# EAGLE design simple-differential-electrostatic-rev1 (EAGLE 6.1)

## Sheet 1 of 4
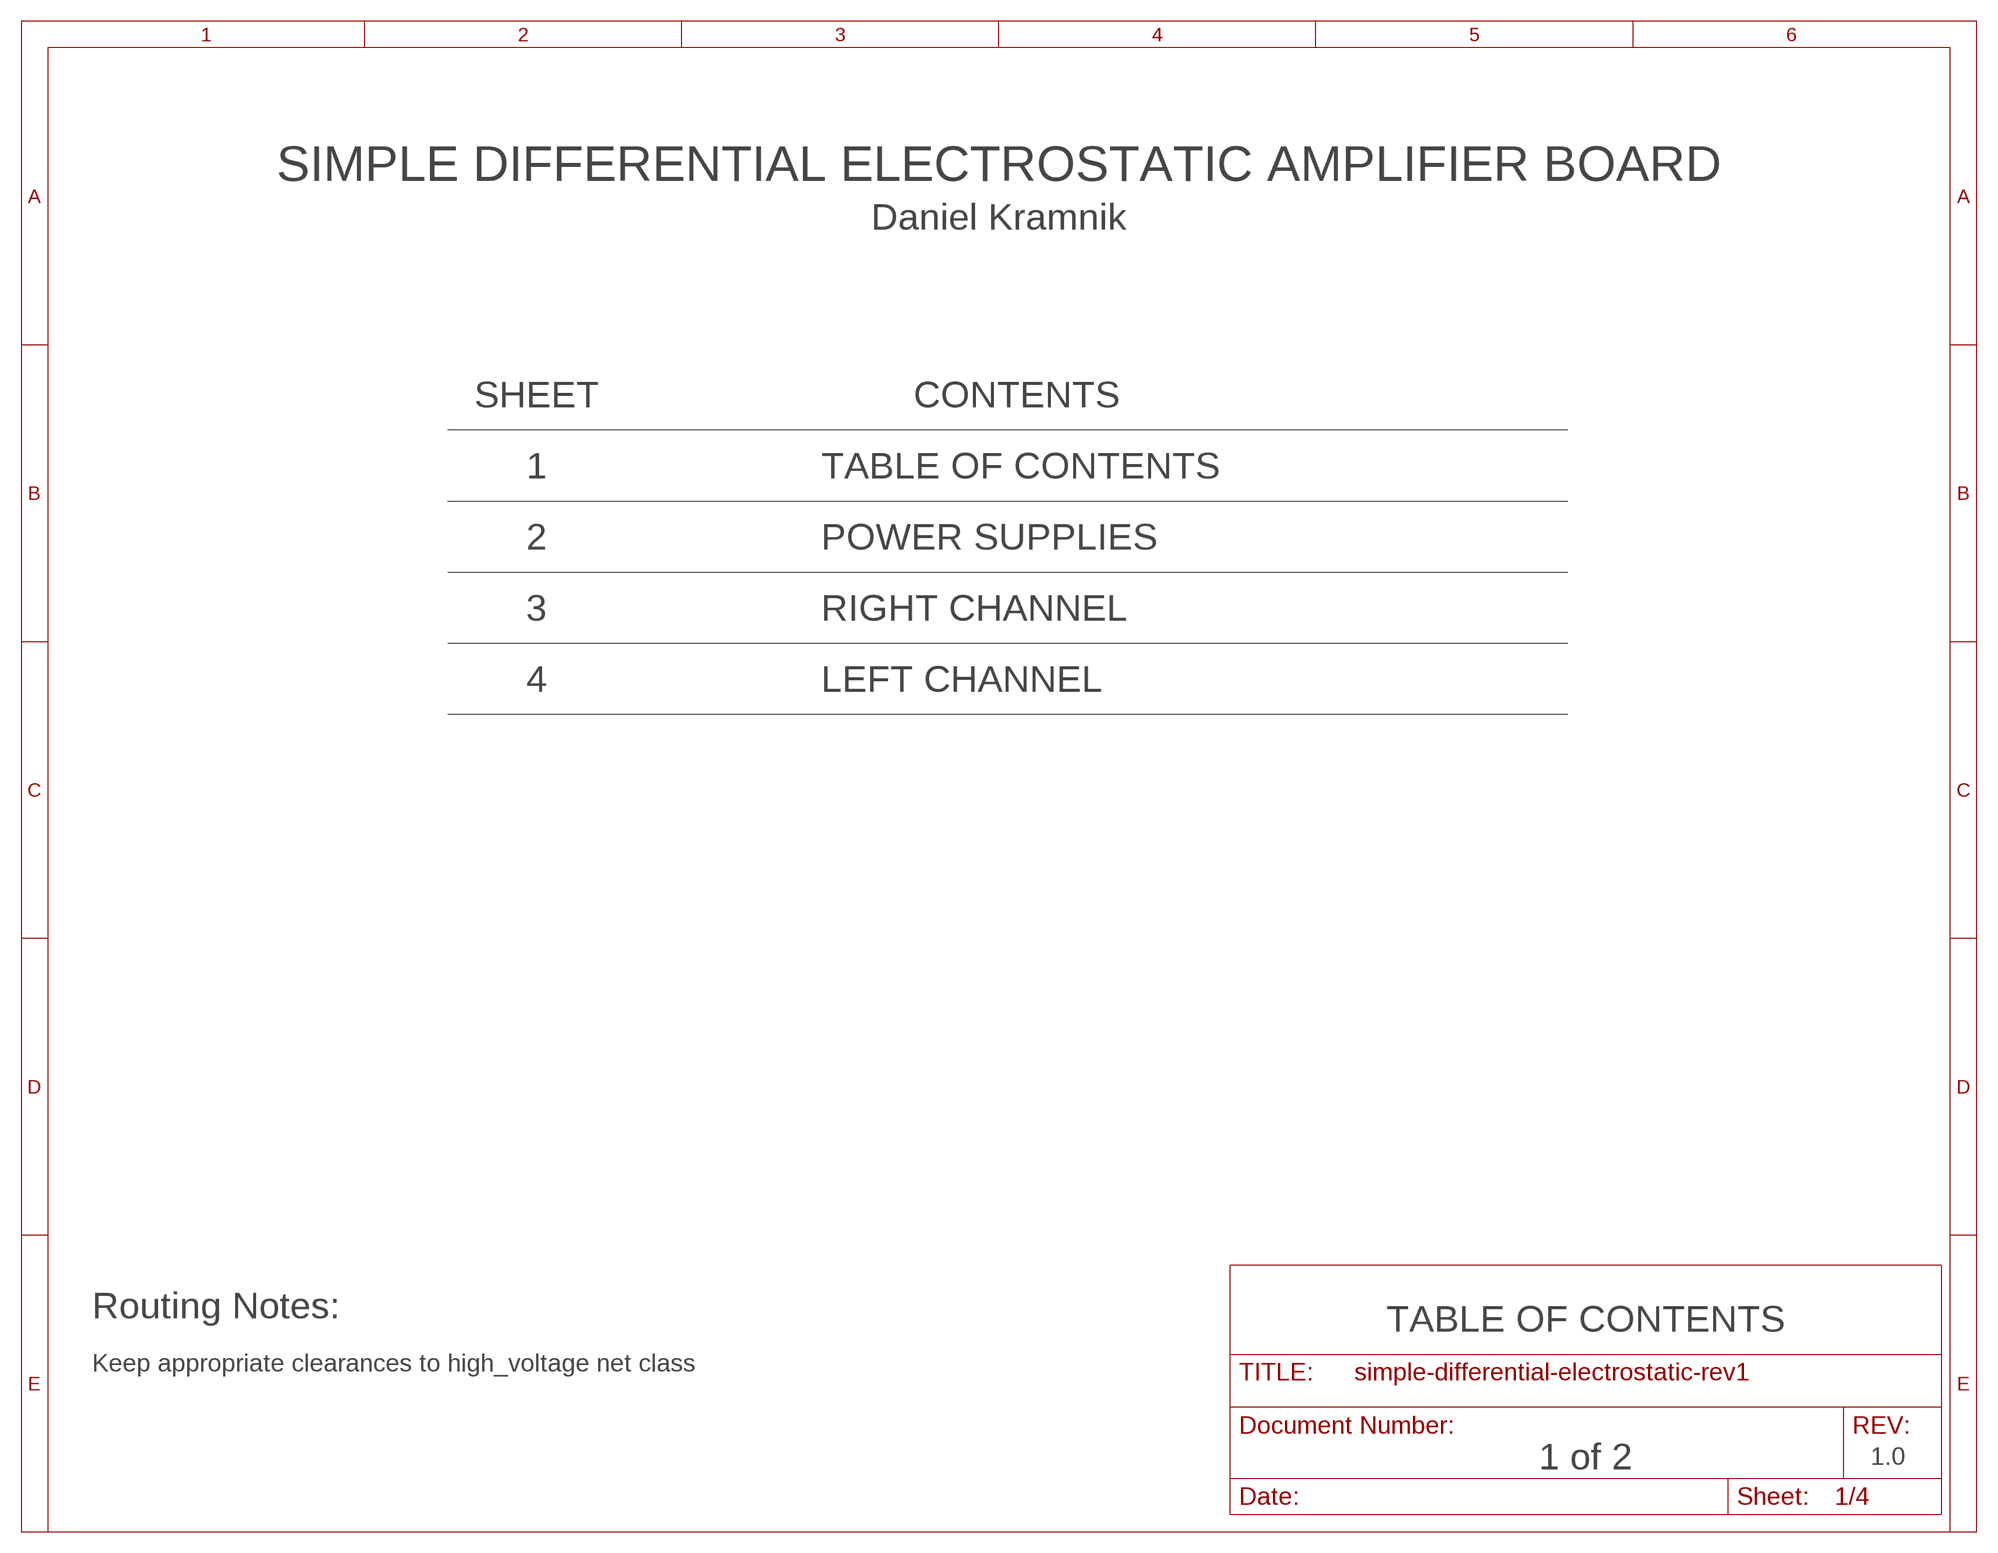
[diagram p0: schematic, sheet 1]

### Notes on the sheet
- SIMPLE DIFFERENTIAL ELECTROSTATIC AMPLIFIER BOARD
- Daniel Kramnik
- SHEET | CONTENTS
- 1 | TABLE OF CONTENTS
- 2 | POWER SUPPLIES
- 3 | RIGHT CHANNEL
- 4 | LEFT CHANNEL
- Routing Notes: | TABLE OF CONTENTS
- Keep appropriate clearances to high_voltage net class
- 1 of 2 | 1.0

## Sheet 2 of 4
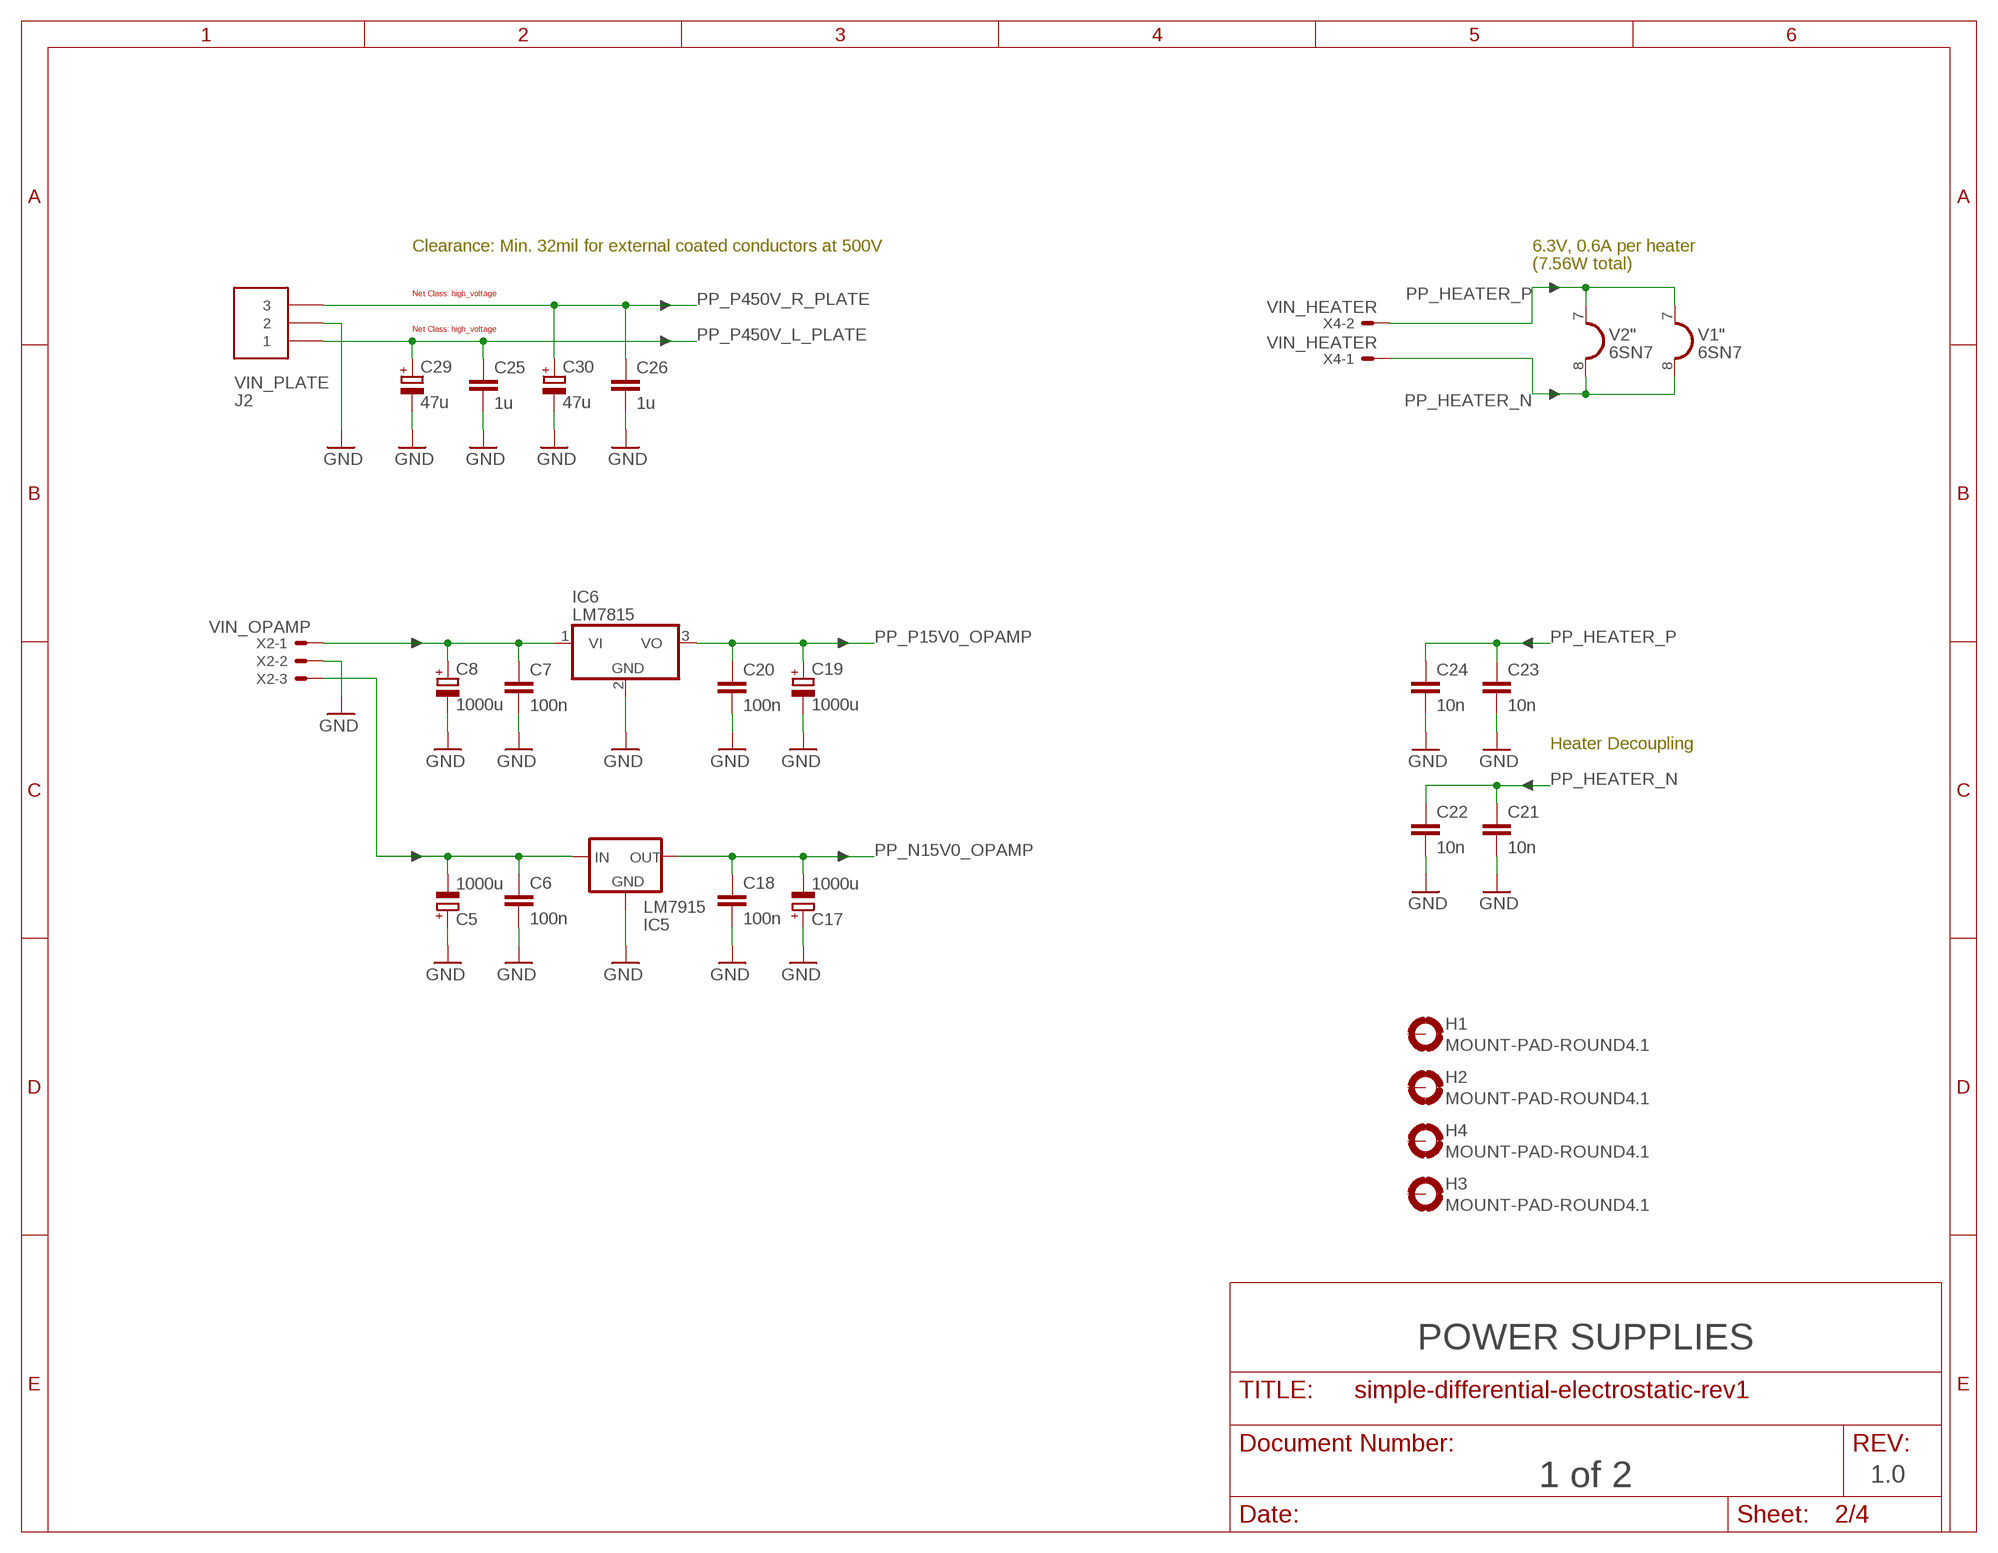
[diagram p1: schematic, sheet 2]

### Parts
C5  1000u  CPOL-EUE5-10.5  [E5-10,5]
C6  100n  C-EU050-025X075  [C050-025X075]
C7  100n  C-EU050-025X075  [C050-025X075]
C8  1000u  CPOL-EUE5-10.5  [E5-10,5]
C17  1000u  CPOL-EUE5-10.5  [E5-10,5]
C18  100n  C-EU050-025X075  [C050-025X075]
C19  1000u  CPOL-EUE5-10.5  [E5-10,5]
C20  100n  C-EU050-025X075  [C050-025X075]
C21  10n  C-EU050-025X075  [C050-025X075]
C22  10n  C-EU050-025X075  [C050-025X075]
C23  10n  C-EU050-025X075  [C050-025X075]
C24  10n  C-EU050-025X075  [C050-025X075]
C25  1u  C-EU325-137X374  [C325-137X374]
C26  1u  C-EU325-137X374  [C325-137X374]
C29  47u  CPOL-EUE10-22.5  [EB22,5D]
C30  47u  CPOL-EUE10-22.5  [EB22,5D]
H1  MOUNT-PAD-ROUND4.1  [4,1-PAD]
H2  MOUNT-PAD-ROUND4.1  [4,1-PAD]
H3  MOUNT-PAD-ROUND4.1  [4,1-PAD]
H4  MOUNT-PAD-ROUND4.1  [4,1-PAD]
IC5  LM7915  79XXS  [79XXS]
IC6  LM7815  7815TV  [TO220V]
J2  VIN_PLATE  CONN_MOLEX_3PIN_MINI-FIT_JR  [CONN_MOLEX_3PIN_MINI-FIT_JR]
V1  6SN7  6SN7GT-P  [OKTAL]
V2  6SN7  6SN7GT-P  [OKTAL]
X2  VIN_OPAMP  KK-156-3  [KK-156-3]
X4  VIN_HEATER  KK-156-2  [KK-156-2]

### Nets
GND: C5.+ C6.2 C7.2 C8.- C17.+ C18.2 C19.- C20.2 C21.2 C22.2 C23.2 C24.2 C25.2 C26.2 C29.- C30.- IC5.GND IC6.2(GND) J2.2 X2.2 ; also sheet 3,4
N$28: C5.- C6.1 IC5.IN X2.3
N$30: C7.1 C8.+ IC6.1(VI) X2.1
PP_HEATER_N: C21.1 C22.1 V1.8(":H2) V2.8(":H2) X4.1
PP_HEATER_P: C23.1 C24.1 V1.7(":H1) V2.7(":H1) X4.2
PP_N15V0_OPAMP: C17.- C18.1 IC5.OUT ; also sheet 3,4
PP_P15V0_OPAMP: C19.+ C20.1 IC6.3(VO) ; also sheet 3,4
PP_P450V_L_PLATE [high_voltage]: C25.1 C29.+ J2.1 ; also sheet 4
PP_P450V_R_PLATE [high_voltage]: C26.1 C30.+ J2.3 ; also sheet 3
Unconnected: H1.B4,1(MOUNT) H2.B4,1(MOUNT) H3.B4,1(MOUNT) H4.B4,1(MOUNT)

### Notes on the sheet
- Clearance: Min. 32mil for external coated conductors at 500V | 6.3V, 0.6A per heater
- (7.56W total)
- Net Class: high_voltage
- Net Class: high_voltage
- Heater Decoupling
- POWER SUPPLIES
- 1 of 2 | 1.0

## Sheet 3 of 4
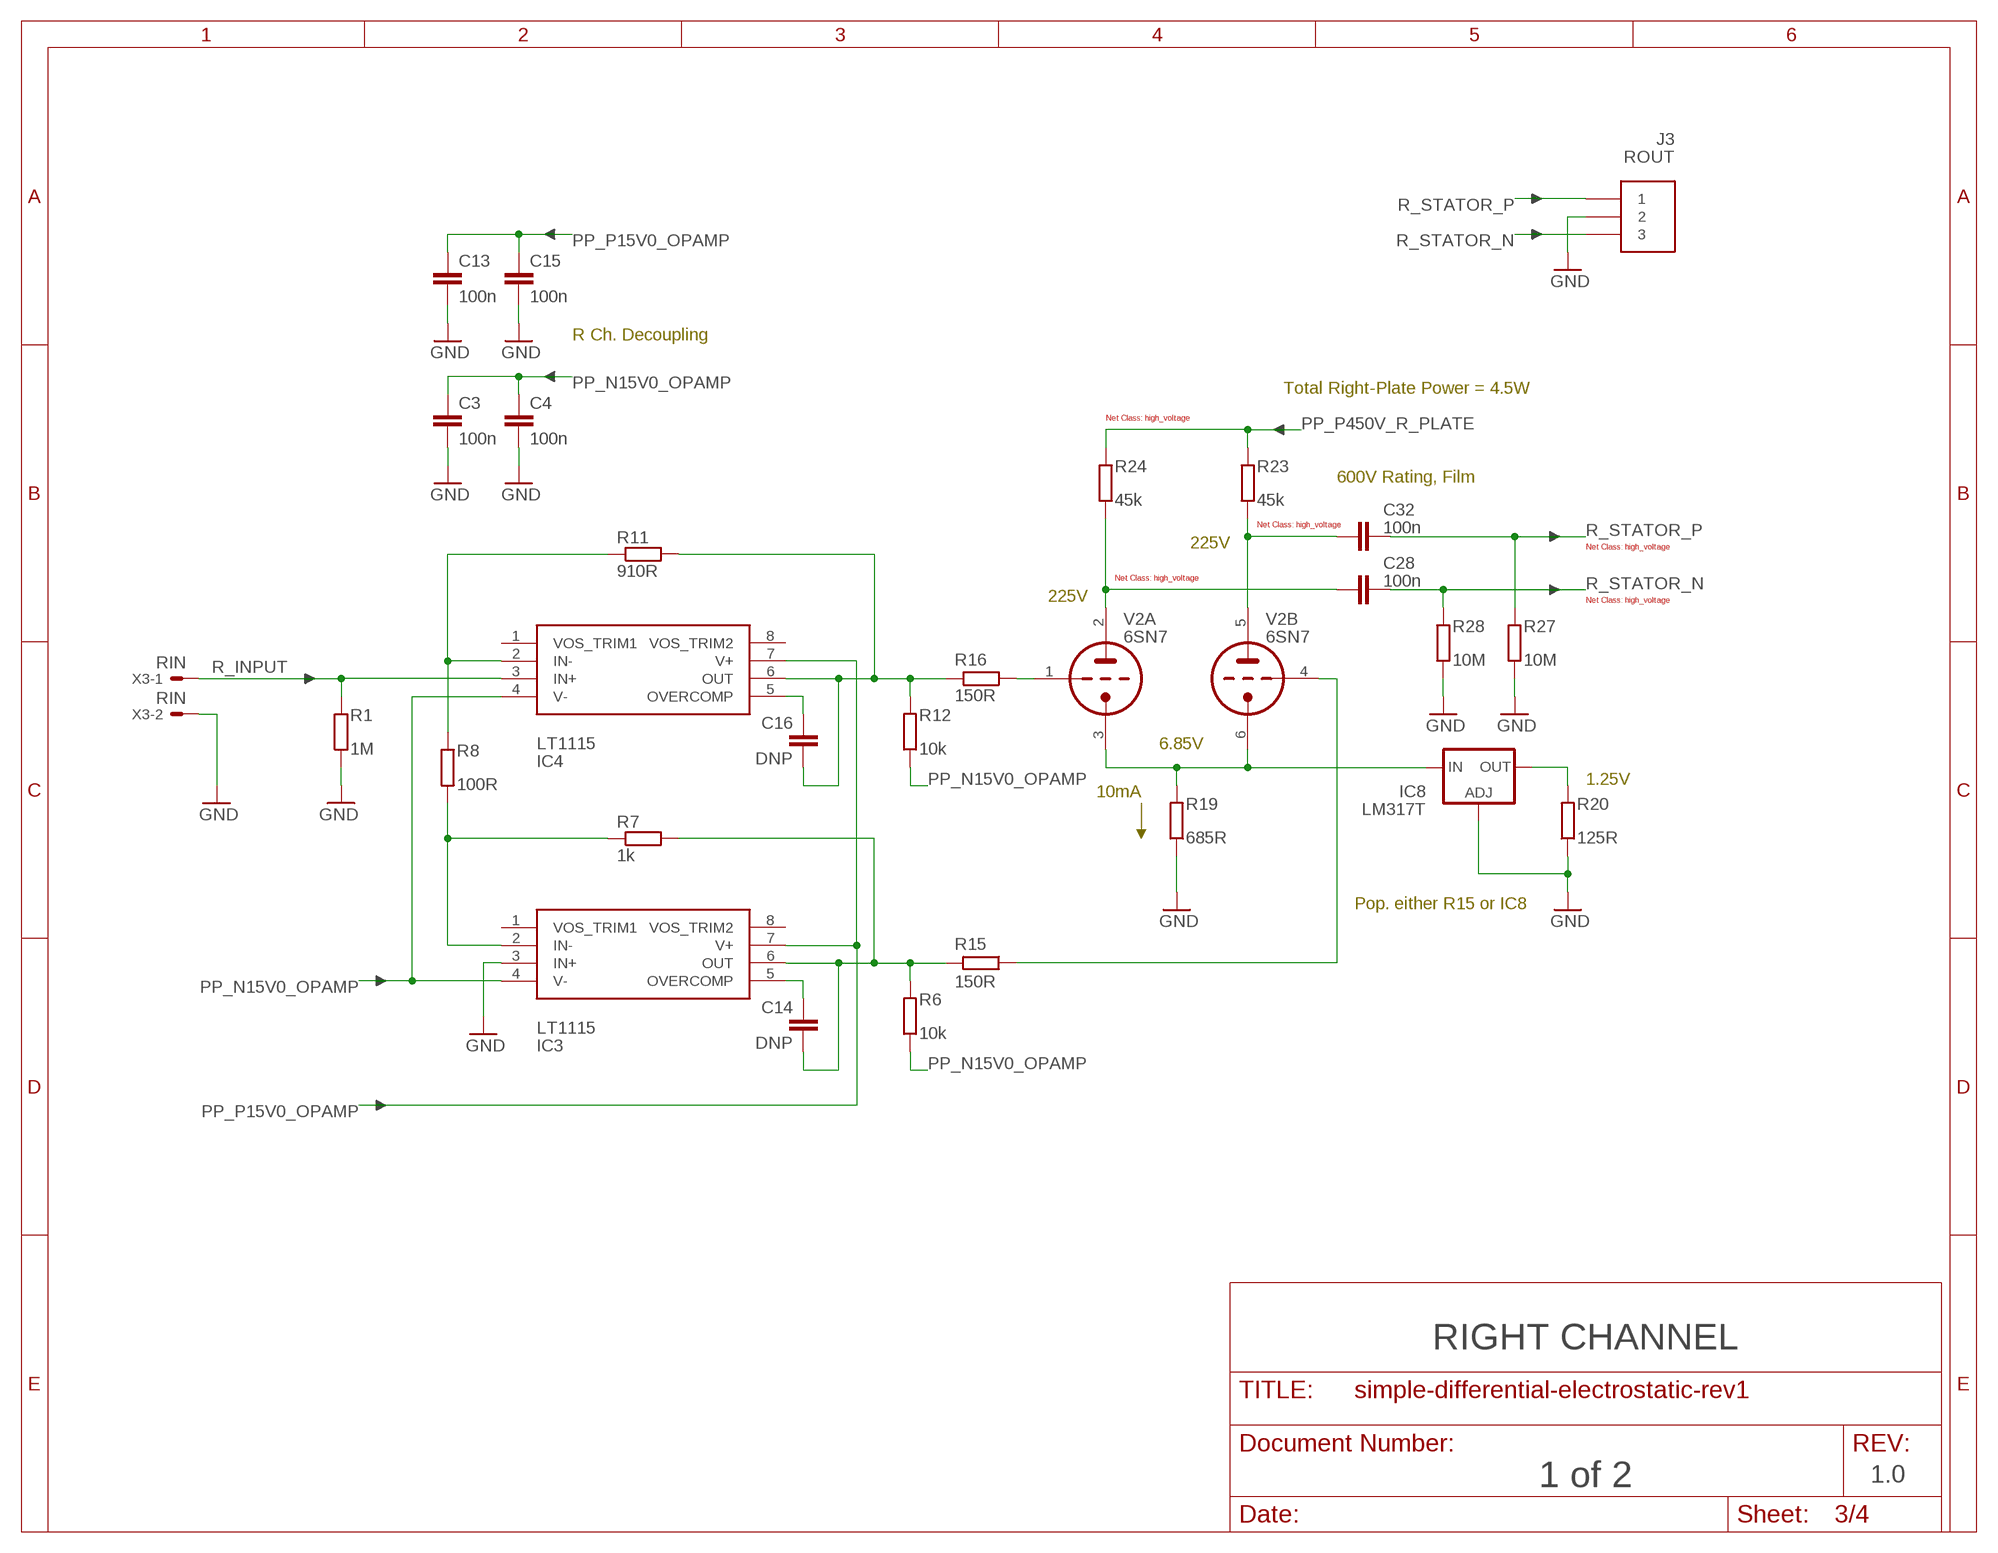
[diagram p2: schematic, sheet 3]

### Parts
C3  100n  C-EU050-025X075  [C050-025X075]
C4  100n  C-EU050-025X075  [C050-025X075]
C13  100n  C-EU050-025X075  [C050-025X075]
C14  DNP  C-EU050-025X075  [C050-025X075]
C15  100n  C-EU050-025X075  [C050-025X075]
C16  DNP  C-EU050-025X075  [C050-025X075]
C28  100n  C-EU375-155X418  [C375-155X418]
C32  100n  C-EU375-155X418  [C375-155X418]
IC3  LT1115  [DIL08]
IC4  LT1115  [DIL08]
IC8  LM317T  LM317TS  [317TS]
J3  ROUT  CONN_MOLEX_3PIN_MINI-FIT_JR  [CONN_MOLEX_3PIN_MINI-FIT_JR]
R1  1M  R-EU_0309/10  [0309/10]
R6  10k  R-EU_0309/10  [0309/10]
R7  1k  R-EU_0309/10  [0309/10]
R8  100R  R-EU_0309/10  [0309/10]
R11  910R  R-EU_0309/10  [0309/10]
R12  10k  R-EU_0309/10  [0309/10]
R15  150R  R-EU_0309/10  [0309/10]
R16  150R  R-EU_0309/10  [0309/10]
R19  685R  R-EU_0309/10  [0309/10]
R20  125R  R-EU_0309/10  [0309/10]
R23  45k  R-EU_0613/15  [P0613/15]
R24  45k  R-EU_0613/15  [P0613/15]
R27  10M  R-EU_0309/10  [0309/10]
R28  10M  R-EU_0309/10  [0309/10]
X3  RIN  KK-156-2  [KK-156-2]

### Nets
GND: C3.2 C4.2 C13.2 C15.2 IC3.3(IN+) IC8.1(ADJ) J3.2 R1.1 R19.1 R20.1 R27.1 R28.1 X3.2 ; also sheet 2,4
N$1: IC8.3(IN) R19.2 V2.3(A:TK) V2.6(B:TK)
N$2 [high_voltage]: C28.1 R24.1 V2.2(A:TA)
N$3 [high_voltage]: C32.1 R23.1 V2.5(B:TA)
N$4: C16.2 IC4.6(OUT) R11.2 R12.2 R16.2
N$7: R15.1 V2.4(B:TG)
N$8: R16.1 V2.1(A:TG)
N$10: IC4.2(IN-) R8.1 R11.1
N$13: IC3.2(IN-) R7.1 R8.2
N$14: C14.2 IC3.6(OUT) R6.2 R7.2 R15.2
N$25: IC8.2(OUT) R20.2
N$26: C16.1 IC4.5(OVERCOMP)
N$27: C14.1 IC3.5(OVERCOMP)
PP_N15V0_OPAMP: C3.1 C4.1 IC3.4(V-) IC4.4(V-) R6.1 R12.1 ; also sheet 2,4
PP_P15V0_OPAMP: C13.1 C15.1 IC3.7(V+) IC4.7(V+) ; also sheet 2,4
PP_P450V_R_PLATE [high_voltage]: R23.2 R24.2 ; also sheet 2
R_INPUT: IC4.3(IN+) R1.2 X3.1
R_STATOR_N [high_voltage]: C28.2 J3.3 R28.2
R_STATOR_P [high_voltage]: C32.2 J3.1 R27.2
Unconnected: IC3.1(VOS_TRIM1) IC3.8(VOS_TRIM2) IC4.1(VOS_TRIM1) IC4.8(VOS_TRIM2)

### Notes on the sheet
- R Ch. Decoupling
- Total Right-Plate Power = 4.5W
- Net Class: high_voltage
- 600V Rating, Film
- Net Class: high_voltage
- 225V
- Net Class: high_voltage
- Net Class: high_voltage
- 225V
- Net Class: high_voltage
- 6.85V
- 10mA | 1.25V
- Pop. either R15 or IC8
- RIGHT CHANNEL
- 1 of 2 | 1.0

## Sheet 4 of 4
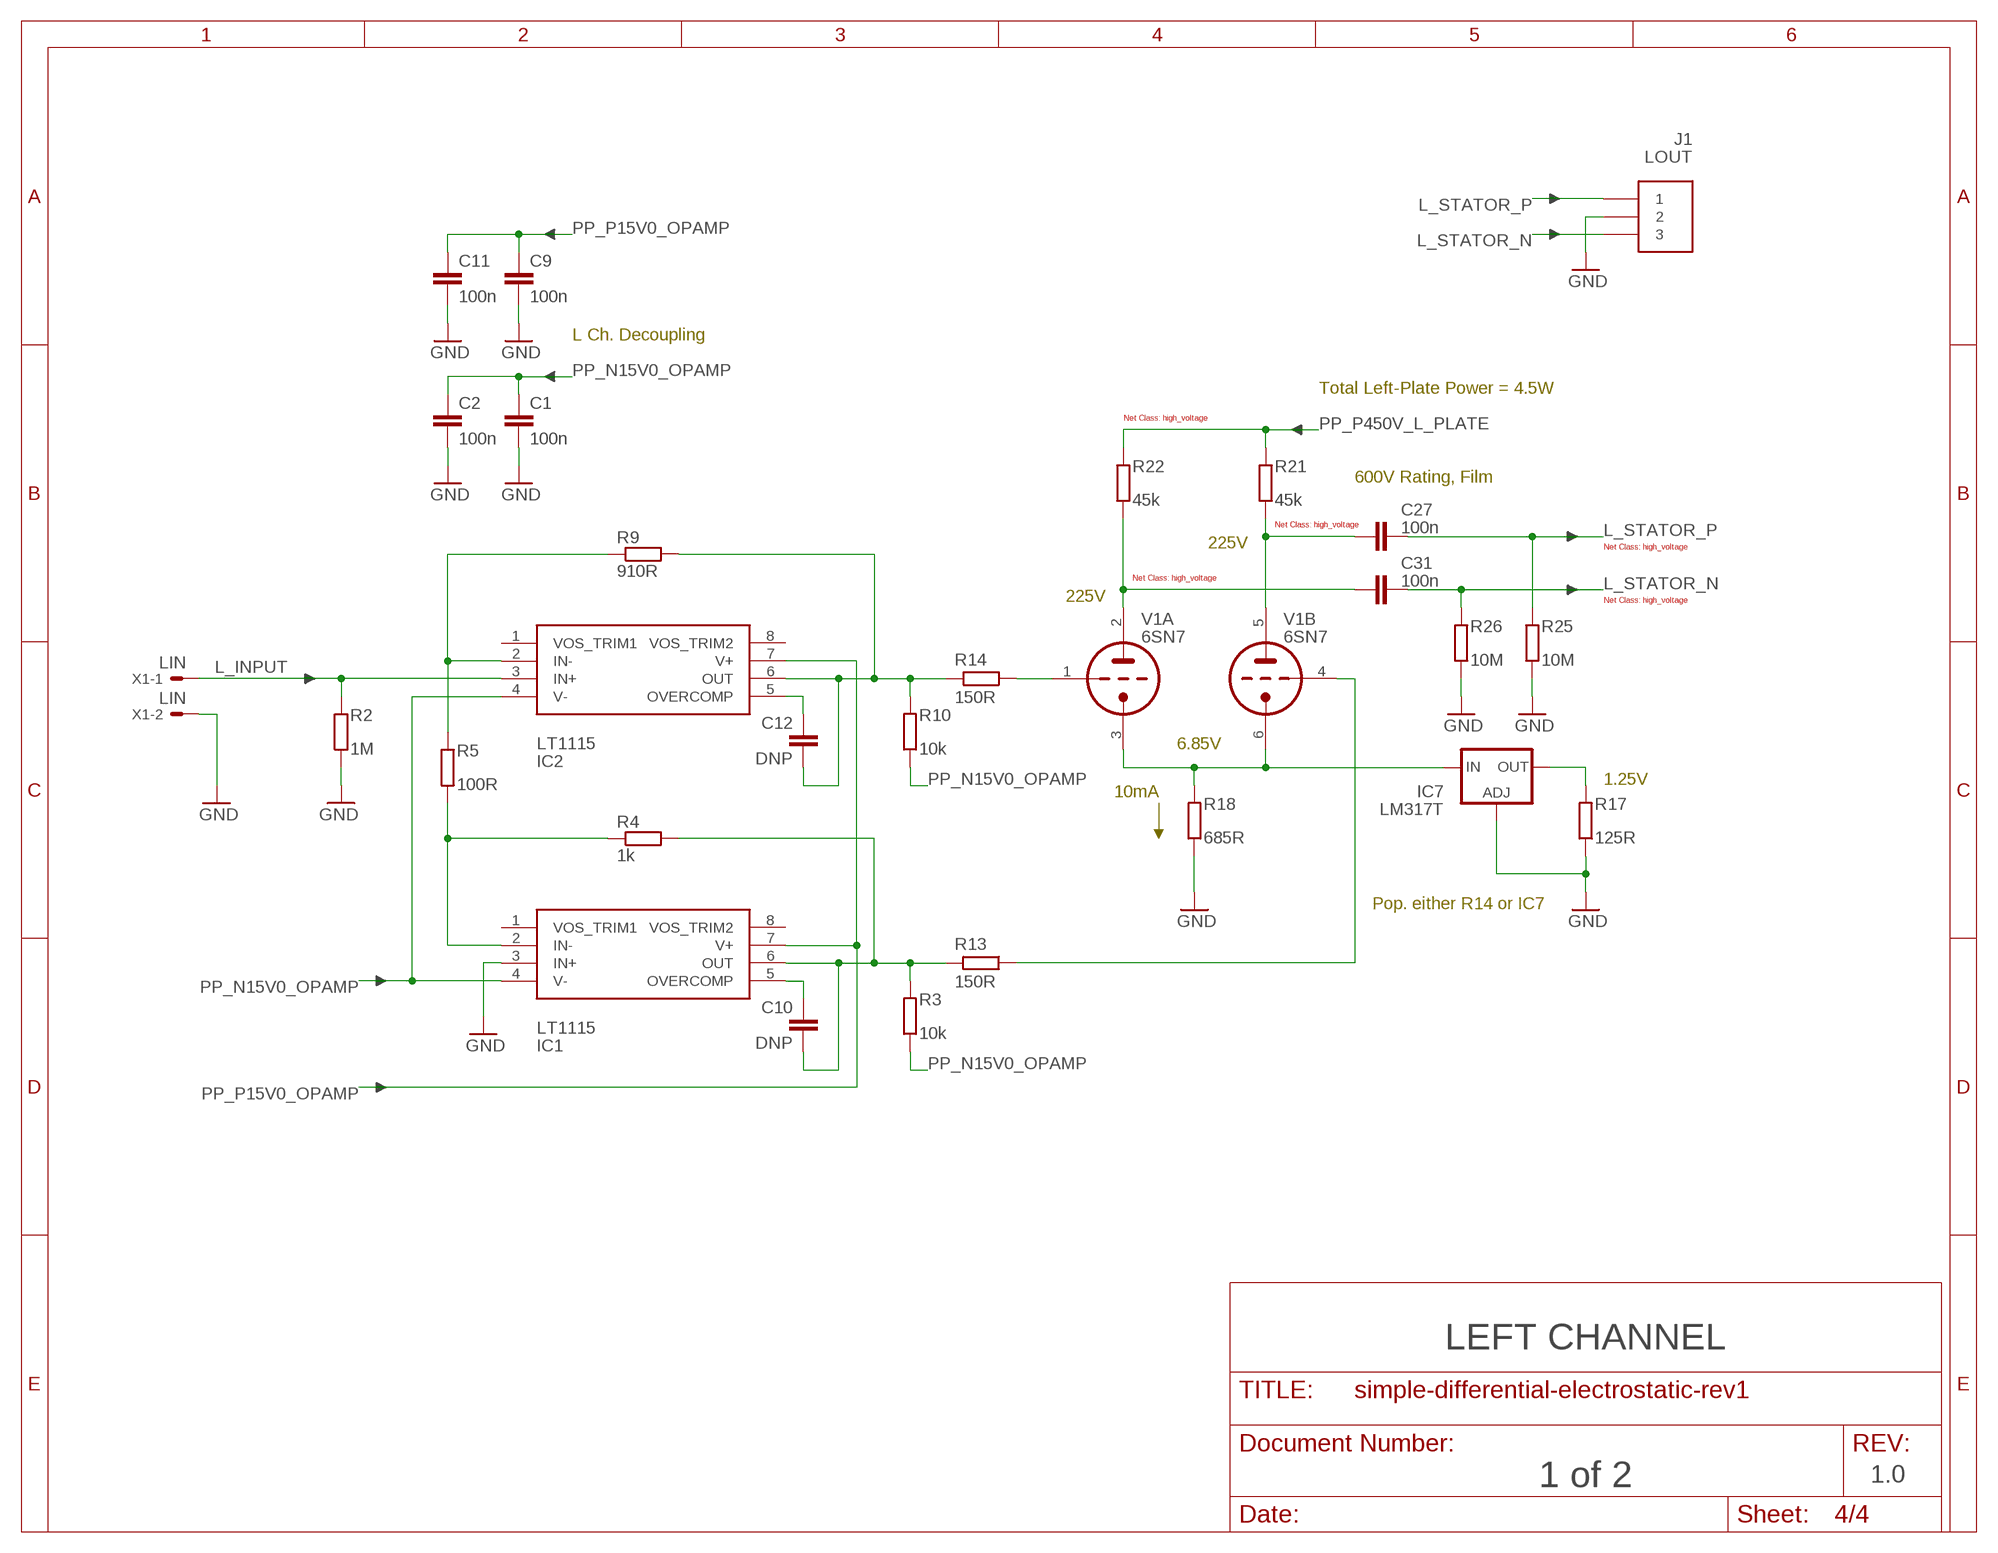
[diagram p3: schematic, sheet 4]

### Parts
C1  100n  C-EU050-025X075  [C050-025X075]
C2  100n  C-EU050-025X075  [C050-025X075]
C9  100n  C-EU050-025X075  [C050-025X075]
C10  DNP  C-EU050-025X075  [C050-025X075]
C11  100n  C-EU050-025X075  [C050-025X075]
C12  DNP  C-EU050-025X075  [C050-025X075]
C27  100n  C-EU375-155X418  [C375-155X418]
C31  100n  C-EU375-155X418  [C375-155X418]
IC1  LT1115  [DIL08]
IC2  LT1115  [DIL08]
IC7  LM317T  LM317TS  [317TS]
J1  LOUT  CONN_MOLEX_3PIN_MINI-FIT_JR  [CONN_MOLEX_3PIN_MINI-FIT_JR]
R2  1M  R-EU_0309/10  [0309/10]
R3  10k  R-EU_0309/10  [0309/10]
R4  1k  R-EU_0309/10  [0309/10]
R5  100R  R-EU_0309/10  [0309/10]
R9  910R  R-EU_0309/10  [0309/10]
R10  10k  R-EU_0309/10  [0309/10]
R13  150R  R-EU_0309/10  [0309/10]
R14  150R  R-EU_0309/10  [0309/10]
R17  125R  R-EU_0309/10  [0309/10]
R18  685R  R-EU_0309/10  [0309/10]
R21  45k  R-EU_0613/15  [P0613/15]
R22  45k  R-EU_0613/15  [P0613/15]
R25  10M  R-EU_0309/10  [0309/10]
R26  10M  R-EU_0309/10  [0309/10]
X1  LIN  KK-156-2  [KK-156-2]

### Nets
GND: C1.2 C2.2 C9.2 C11.2 IC1.3(IN+) IC7.1(ADJ) J1.2 R2.1 R17.1 R18.1 R25.1 R26.1 X1.2 ; also sheet 2,3
L_INPUT: IC2.3(IN+) R2.2 X1.1
L_STATOR_N [high_voltage]: C31.2 J1.3 R26.2
L_STATOR_P [high_voltage]: C27.2 J1.1 R25.2
N$5: IC7.3(IN) R18.2 V1.3(A:TK) V1.6(B:TK)
N$6 [high_voltage]: C31.1 R22.1 V1.2(A:TA)
N$12 [high_voltage]: C27.1 R21.1 V1.5(B:TA)
N$15: R13.1 V1.4(B:TG)
N$16: R14.1 V1.1(A:TG)
N$17: C12.2 IC2.6(OUT) R9.2 R10.2 R14.2
N$19: IC2.2(IN-) R5.1 R9.1
N$21: IC1.2(IN-) R4.1 R5.2
N$22: C10.2 IC1.6(OUT) R3.2 R4.2 R13.2
N$29: C12.1 IC2.5(OVERCOMP)
N$31: C10.1 IC1.5(OVERCOMP)
N$36: IC7.2(OUT) R17.2
PP_N15V0_OPAMP: C1.1 C2.1 IC1.4(V-) IC2.4(V-) R3.1 R10.1 ; also sheet 2,3
PP_P15V0_OPAMP: C9.1 C11.1 IC1.7(V+) IC2.7(V+) ; also sheet 2,3
PP_P450V_L_PLATE [high_voltage]: R21.2 R22.2 ; also sheet 2
Unconnected: IC1.1(VOS_TRIM1) IC1.8(VOS_TRIM2) IC2.1(VOS_TRIM1) IC2.8(VOS_TRIM2)

### Notes on the sheet
- L Ch. Decoupling
- Total Left-Plate Power = 4.5W
- Net Class: high_voltage
- 600V Rating, Film
- Net Class: high_voltage
- 225V
- Net Class: high_voltage
- Net Class: high_voltage
- 225V
- Net Class: high_voltage
- 6.85V
- 10mA | 1.25V
- Pop. either R14 or IC7
- LEFT CHANNEL
- 1 of 2 | 1.0

## Library data of the parts
C1-C4 C6 C7 C9-C16 C18 C20-C28 C31 C32 = rcl:C-EU: CAPACITOR, European symbol
C5 C8 C17 C19 C29 C30 = rcl:CPOL-EU: POLARIZED CAPACITOR, European symbol
H1-H4 = holes:MOUNT-PAD-ROUND: MOUNTING PAD, round
IC1-IC4 = Kramnik's Library:LT1115
IC5 = v-reg:79XXS: VOLTAGE REGULATOR
IC6 = linear:78*: Positive VOLTAGE REGULATOR Source: http://cache.national.com/ds/LM/LM78L05.pdf http://www.fairchildsemi.com/ds/LM/LM7805.pdf
IC7 IC8 = v-reg:LM317TS: VOLTAGE REGULATOR
J1-J3 = Kramnik's Library:CONN_MOLEX_3PIN_MINI-FIT_JR; VALUE: MOLEX_0039302031
R1-R28 = rcl:R-EU_: RESISTOR, European symbol
V1 V2 = tubes:6SN7GT-P
X1 X3 X4 = con-molex:KK-156-2: KK 156 HEADER Source: http://www.molex.com/pdm_docs/sd/026604100_sd.pdf; OC_FARNELL: unknown; OC_NEWARK: unknown
X2 = con-molex:KK-156-3: KK 156 HEADER Source: http://www.molex.com/pdm_docs/sd/026604100_sd.pdf; OC_FARNELL: unknown; OC_NEWARK: unknown

## Net classes
1 high_voltage: width 1.422 mm, clearance 1.422 mm

## Board
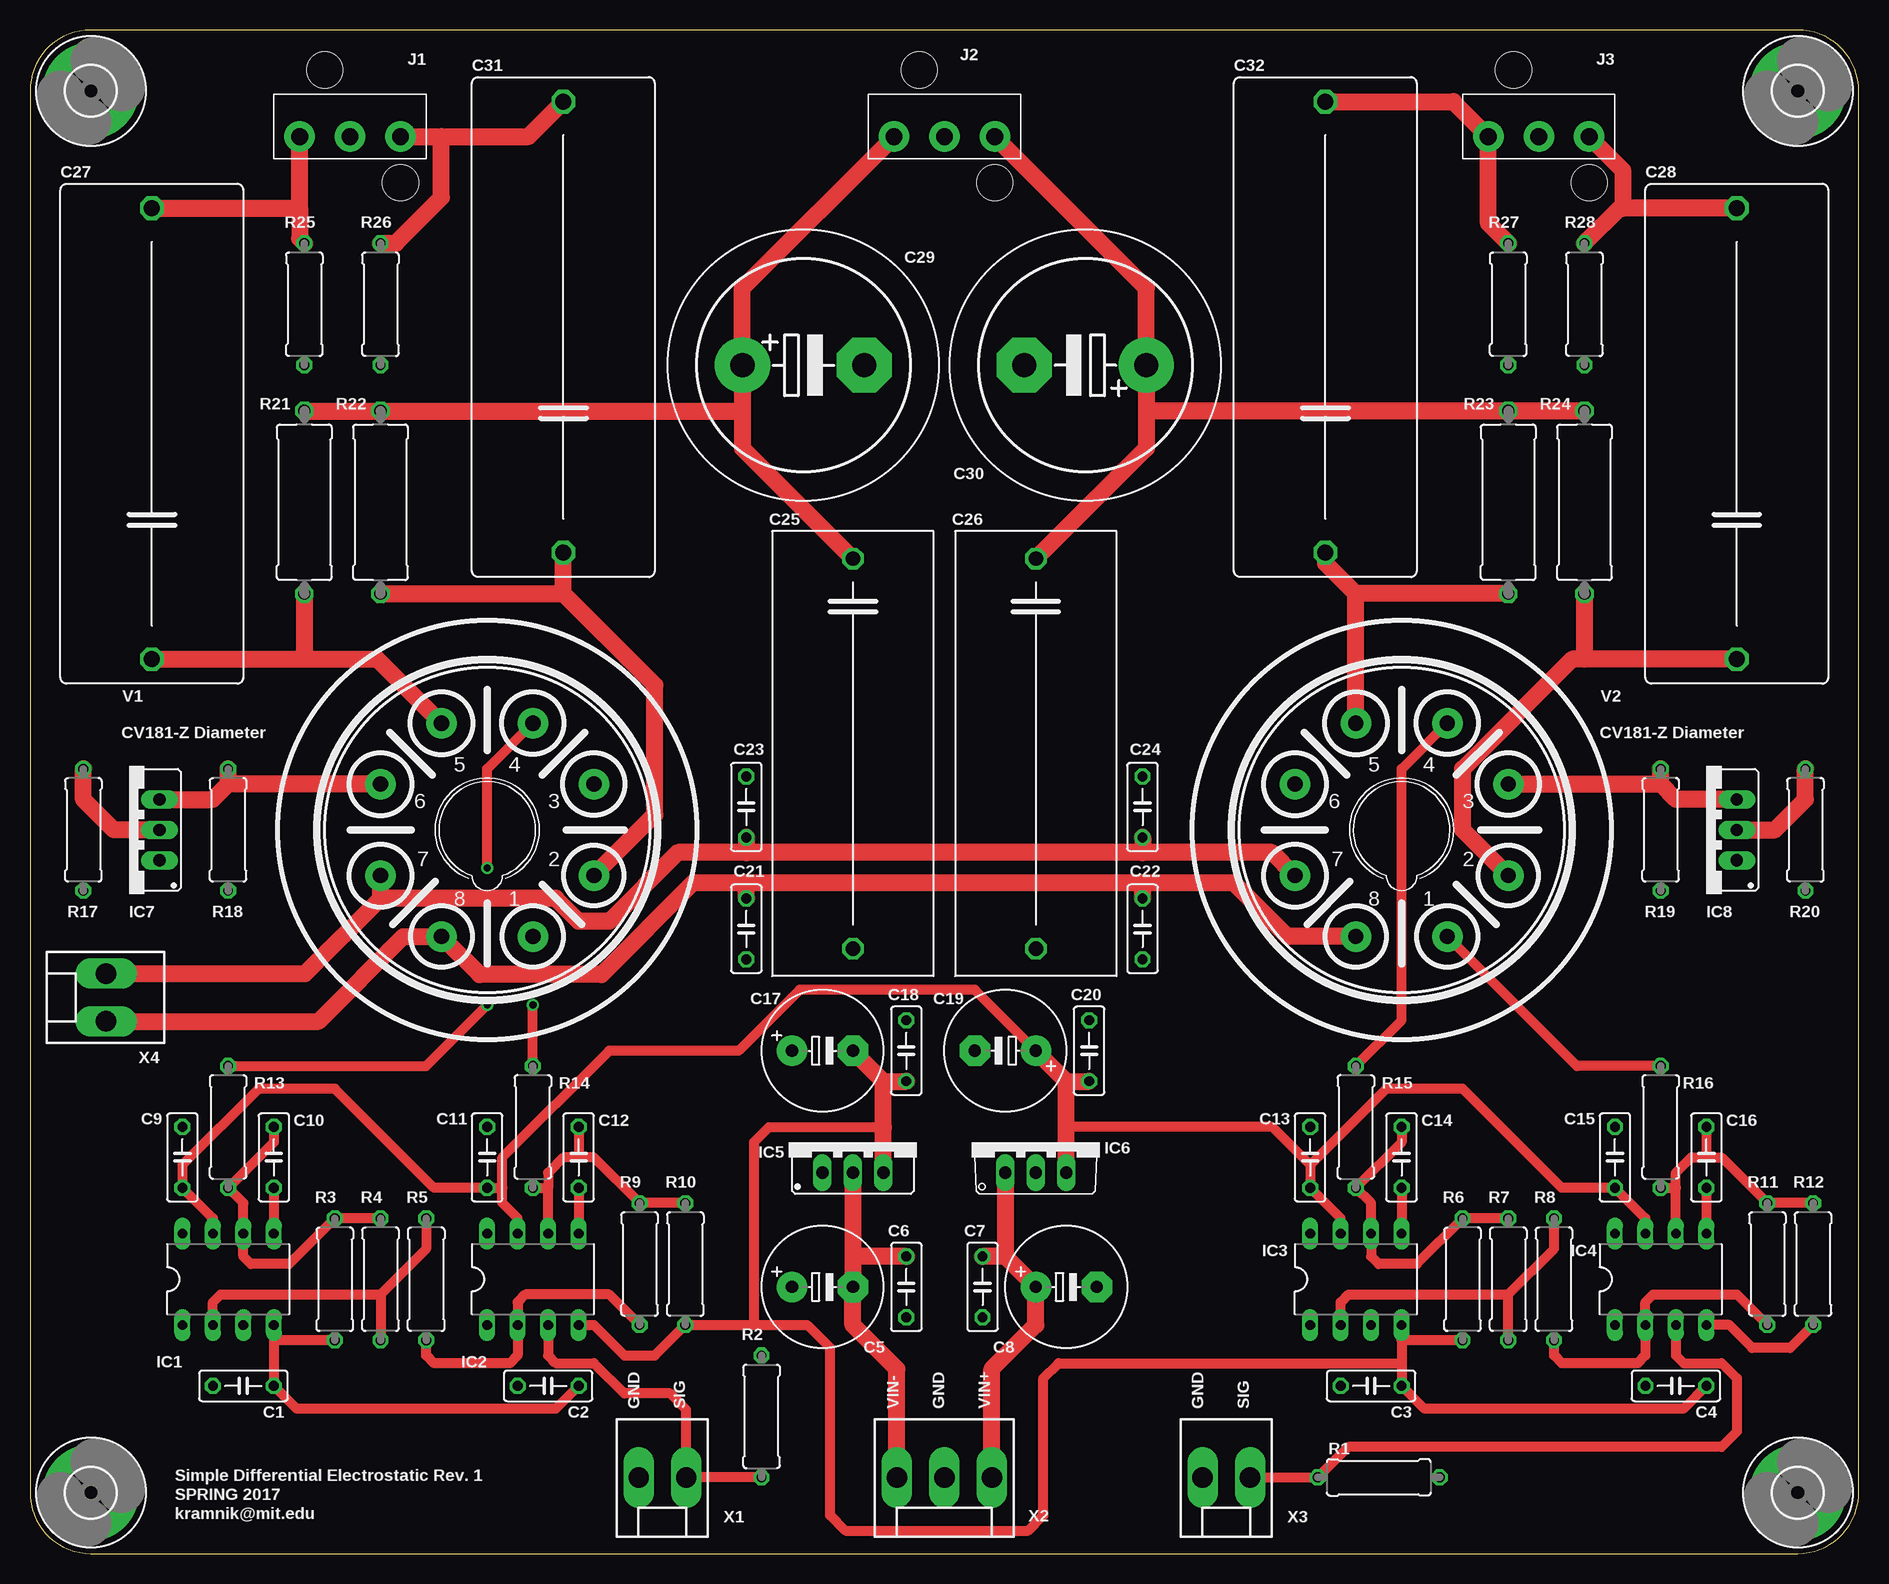
[diagram p4: board, top side]
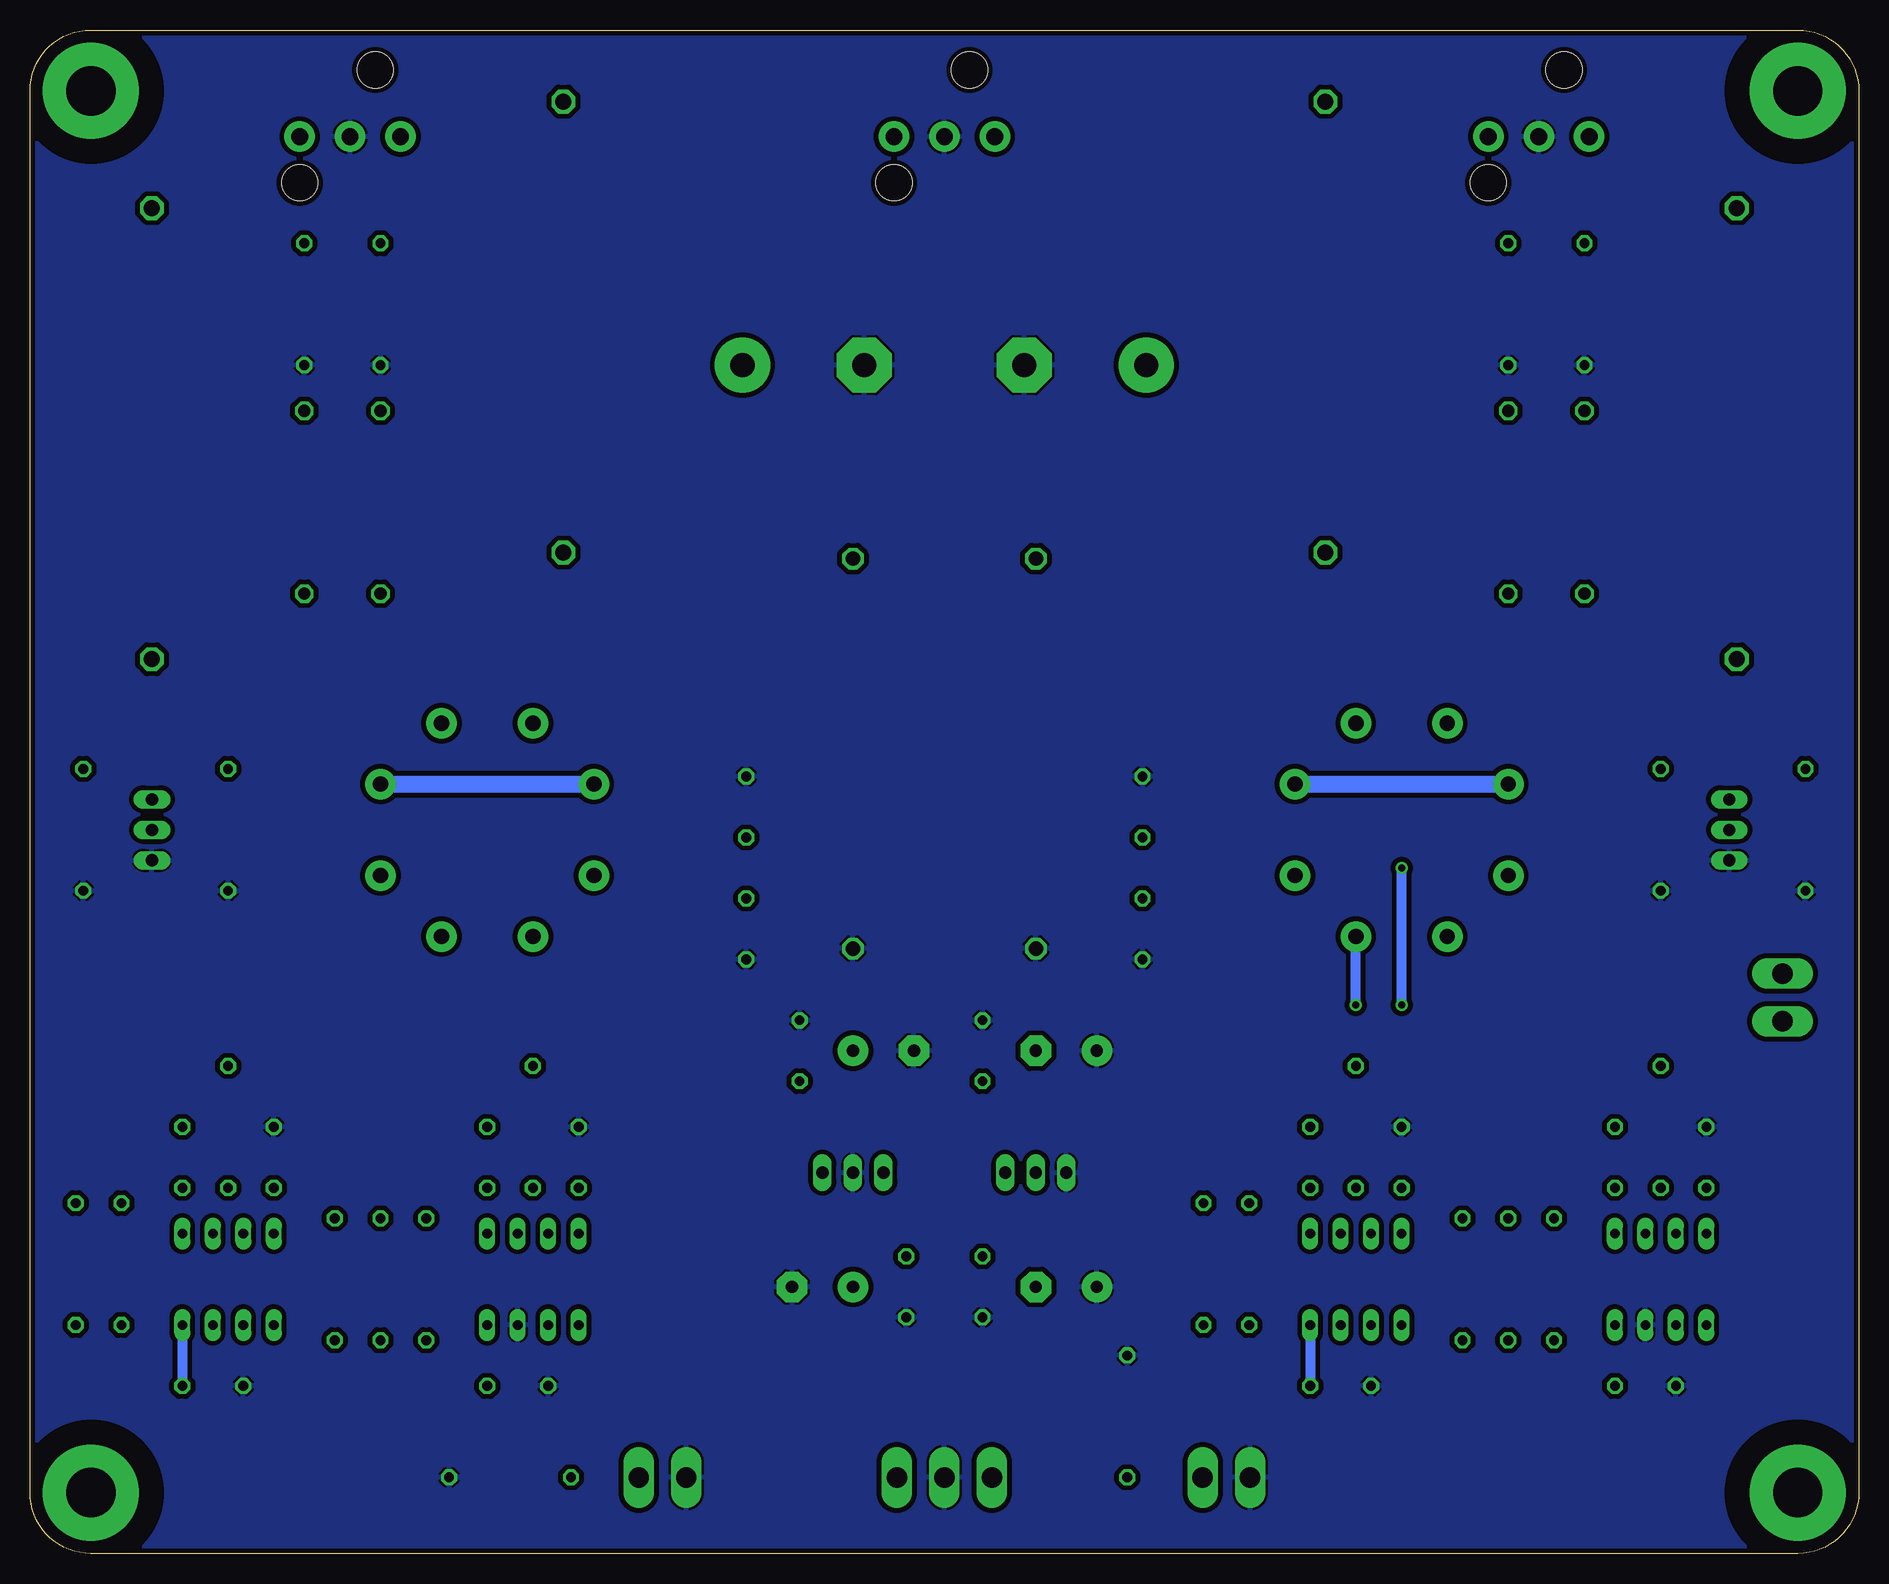
[diagram p5: board, bottom side, seen from below]

Size 152.4 x 127 mm. Coordinates in mm from the lower left corner, seen from the top.
Outline: 0,121.92 0,5.08 arc90 5.08,0 147.32,0 arc90 152.4,5.08 152.4,121.92 arc90 147.32,127 5.08,127 arc90 0,121.92
Copper layers (1*16): Top 0.035mm / dielectric 1.5mm / Bottom 0.035mm
Design rules: minimum track width 10mil, minimum drill 15mil, track to track 16mil, track to pad 16mil, pad to pad 16mil, via to via 16mil, smd to smd 16mil, copper to edge 16mil, drill to drill 16mil, minimum pad ring 10mil, minimum via ring 8mil, stop-mask expansion 4mil, vias tented up to drill 0mil, thermal gap 8mil

### Footprints (pad centres in the part's own frame; a part is rotated, then mirrored left to right if it is on the bottom)
C050-025X075 = drill 0.813 octagon: 1 -2.54,0; 2 2.54,0
E5-10,5 = drill 1.016 pad 2.54: + -2.54,0 | drill 1.016 pad 2.54 octagon: - 2.54,0
C325-137X374 = drill 1.194 octagon: 1 -16.256,0; 2 16.256,0
C375-155X418 = drill 1.321 octagon: 1 -18.796,0; 2 18.796,0
EB22,5D = drill 2.007 pad 4.597: + -5.08,0 | drill 2.007 pad 4.597 octagon: - 5.08,0
4,1-PAD = drill 4.1 pad 8: B4,1 0,0
DIL08 = drill 0.813 long: 1 -3.81,-3.81; 2 -1.27,-3.81; 3 1.27,-3.81; 4 3.81,-3.81; 5 3.81,3.81; 6 1.27,3.81; 7 -1.27,3.81; 8 -3.81,3.81
79XXS = drill 1.016 long: GND -2.54,-2.54; IN 0,-2.54; OUT 2.54,-2.54
TO220V = drill 1.016 long: 1 -2.54,-2.54; 2 0,-2.54; 3 2.54,-2.54
317TS = drill 1.016 long: 1 -2.54,-2.54; 2 0,-2.54; 3 2.54,-2.54
CONN_MOLEX_3PIN_MINI-FIT_JR = drill 1.4 pad 2.54: 1 4.2,0; 2 0,0; 3 -4.2,0 | hole 3: 2.1,-5.55; -4.2,3.85
0309/10 = drill 0.813 octagon: 1 -5.08,0; 2 5.08,0
P0613/15 = drill 1.016 octagon: 1 -7.62,0; 2 7.62,0
OKTAL = drill 1.27 pad 2.54: 1 3.81,-8.89; 2 8.89,-3.81; 3 8.89,3.81; 4 3.81,8.89; 5 -3.81,8.89; 6 -8.89,3.81; 7 -8.89,-3.81; 8 -3.81,-8.89
KK-156-2 = drill 1.7 pad 2.184 long: 1 -1.98,0; 2 1.98,0
KK-156-3 = drill 1.7 pad 2.184 long: 1 -3.96,0; 2 0,0; 3 3.96,0

### Placement (x,y rotation side)
C1  17.78,13.97 180 top
C2  43.18,13.97 180 top
C3  111.76,13.97 180 top
C4  137.16,13.97 180 top
C5  66.04,22.23 0 top
C6  73.03,22.23 270 top
C7  79.38,22.23 270 top
C8  86.36,22.23 0 top
C9  12.7,33.02 90 top
C10  20.32,33.02 90 top
C11  38.1,33.02 90 top
C12  45.72,33.02 90 top
C13  106.68,33.02 90 top
C14  114.3,33.02 90 top
C15  132.08,33.02 90 top
C16  139.7,33.02 90 top
C17  66.04,41.91 0 top
C18  73.03,41.91 90 top
C19  81.28,41.91 180 top
C20  88.27,41.91 90 top
C21  59.69,52.07 270 top
C22  92.71,52.07 270 top
C23  59.69,62.23 90 top
C24  92.71,62.23 90 top
C25  68.58,66.67 270 top
C26  83.82,66.67 270 top
C27  10.16,93.34 90 top
C28  142.24,93.34 90 top
C29  64.45,99.06 0 top
C30  87.95,99.06 180 top
C31  44.45,102.23 90 top
C32  107.95,102.23 90 top
H1  5.08,5.08 0 top
H2  147.32,5.08 0 top
H3  5.08,121.92 0 top
H4  147.32,121.92 0 top
IC1  16.51,22.86 0 top
IC2  41.91,22.86 0 top
IC3  110.49,22.86 0 top
IC4  135.89,22.86 0 top
IC5  68.58,34.29 0 top
IC6  83.82,34.29 0 top
IC7  8.26,60.33 90 top
IC8  139.7,60.33 90 top
J1  26.67,118.11 180 top
J2  76.2,118.11 180 top
J3  125.73,118.11 180 top
R1  112.39,6.35 180 top
R2  60.96,11.43 270 top
R3  25.4,22.86 90 top
R4  29.21,22.86 90 top
R5  33.02,22.86 90 top
R6  119.38,22.86 90 top
R7  123.19,22.86 90 top
R8  127,22.86 90 top
R9  50.8,24.13 90 top
R10  54.61,24.13 90 top
R11  144.78,24.13 90 top
R12  148.59,24.13 90 top
R13  16.51,35.56 270 top
R14  41.91,35.56 270 top
R15  110.49,35.56 270 top
R16  135.89,35.56 270 top
R17  4.45,60.33 90 top
R18  16.51,60.33 90 top
R19  135.89,60.33 90 top
R20  147.96,60.33 90 top
R21  22.86,87.63 90 top
R22  29.21,87.63 90 top
R23  123.19,87.63 90 top
R24  129.54,87.63 90 top
R25  22.86,104.14 90 top
R26  29.21,104.14 90 top
R27  123.19,104.14 90 top
R28  129.54,104.14 90 top
V1  38.1,60.33 0 top
V2  114.3,60.33 0 top
X1  52.7,6.35 180 top
X2  76.2,6.35 180 top
X3  99.69,6.35 180 top
X4  6.35,46.35 90 top

### Tracks (layer width: path | path; a pad name or v marks a point on that pad's centre or on a via)
GND
  pour Bottom: 0,0 152.4,0 152.4,127 0,127
L_INPUT
  Top 0.813: IC2.3 43.18,16.51 43.81,15.88 46.99,15.88 49.53,13.34 53.34,13.34 54.69,11.99 X1.1 R2.2
L_STATOR_N
  Top 1.422: J1.3 34.29,118.11 | 34.29,118.11 41.53,118.11 C31.2 | R26.2 30.48,109.22 34.29,113.03 34.29,118.11
L_STATOR_P
  Top 1.422: C27.2 22.47,112.14 | 22.47,112.14 J1.1 | 22.47,112.14 22.47,109.61 R25.2
N$1
  Top 1.422: V2.3 135.89,64.14 | 135.89,64.14 R19.2 | IC8.3 137.16,62.87 135.89,64.14
  Bottom 1.422: V2.3 V2.6
N$2
  Top 1.422: V2.2 119.38,60.33 119.38,65.41 128.52,74.55 129.54,74.55 | C28.1 129.54,74.55 | R24.1 129.54,74.55
N$3
  Top 1.422: V2.5 110.49,80.01 | R23.1 110.49,80.01 | C32.1 107.95,82.55 110.49,80.01
N$4
  Top 0.813: IC4.6 137.16,30.48 | 137.16,30.48 137.16,31.75 138.43,33.02 139.7,33.02 | 139.7,33.02 140.97,33.02 R11.2 R12.2 | C16.2 139.7,33.02 | R16.2 137.16,30.48
N$5
  Top 1.422: V1.6 16.51,64.14 | 16.51,64.14 R18.2 | IC7.3 15.24,62.87 16.51,64.14
  Bottom 1.422: V1.3 V1.6
N$6
  Top 1.422: V1.2 52.07,61.59 52.07,72.39 44.45,80.01 | R22.1 44.45,80.01 | 44.45,80.01 C31.1
N$7
  Top 0.813: R15.1 114.3,44.45 114.3,65.41 V2.4
N$8
  Top 0.813: R16.1 128.91,40.64 V2.1
N$10
  Top 0.813: R11.1 142.24,21.59 135.25,21.59 134.62,20.95 IC4.2 134.62,16.51 133.99,15.88 127.64,15.88 127,16.51 R8.1
N$12
  Top 1.422: C27.1 22.86,74.55 | 22.86,74.55 28.96,74.55 V1.5 | R21.1 22.86,74.55
N$13
  Top 0.813: IC3.2 109.22,20.95 109.86,21.59 123.19,21.59 | 123.19,21.59 127,25.4 R8.2 | R7.1 123.19,21.59
N$14
  Top 0.813: C14.2 114.3,34.29 R15.2 111.76,29.21 IC3.6 111.76,24.77 112.39,24.13 115.57,24.13 R6.2 R7.2
N$15  (via drill 0.6)
  Top 0.813: R13.1 33.02,40.64 v38.1,45.72 | v38.1,57.15 38.1,65.41 V1.4
  Bottom 0.813: v38.1,45.72 v38.1,57.15
N$16  (via drill 0.6)
  Top 0.813: R14.1 v41.91,45.72
  Bottom 0.813: v41.91,45.72 V1.1
N$17
  Top 0.813: IC2.6 43.18,30.48 | R14.2 43.18,30.48 | C12.2 45.72,33.02 | 45.72,33.02 44.45,33.02 43.18,31.75 43.18,30.48 | 45.72,33.02 46.99,33.02 R9.2 R10.2
N$19
  Top 0.813: R9.1 48.26,21.59 41.27,21.59 40.64,20.95 IC2.2 40.64,16.51 40.01,15.88 33.66,15.88 33.02,16.51 R5.1
N$21
  Top 0.813: IC1.2 15.24,20.95 15.88,21.59 29.21,21.59 | 29.21,21.59 R4.1 | R5.2 33.02,25.4 29.21,21.59
N$22
  Top 0.813: C10.2 20.32,34.29 R13.2 17.78,29.21 IC1.6 17.78,24.77 18.41,24.13 21.59,24.13 R3.2 R4.2
N$25
  Top 1.422: IC8.2 145.41,60.33 147.96,62.87 R20.2
N$26
  Top 0.813: C16.1 IC4.5
N$27
  Top 0.813: C14.1 IC3.5
N$28
  Top 1.422: IC5.IN 68.58,24.77 | 68.58,24.77 C5.- 68.58,19.05 72.24,15.39 X2.3 | C6.1 68.58,24.77
N$29
  Top 0.813: C12.1 IC2.5
N$30
  Top 1.422: IC6.1 81.28,24.77 | 81.28,24.77 C7.1 | 81.28,24.77 C8.+ 83.82,19.05 80.16,15.39 X2.1
N$31
  Top 0.813: C10.1 IC1.5
N$36
  Top 1.422: IC7.2 6.99,60.33 4.45,62.87 R17.2
PP_HEATER_N
  Top 1.422: V2.8 104.78,51.44 100.33,55.88 92.71,55.88 | 92.71,55.88 59.69,55.88 | 59.69,55.88 55.24,55.88 47.62,48.26 37.47,48.26 V1.8 31.11,51.44 24.05,44.38 X4.1 | C21.1 59.69,55.88 | C22.1 92.71,55.88
PP_HEATER_P
  Top 1.422: V2.7 103.5,58.42 92.71,58.42 | 92.71,58.42 59.69,58.42 | 59.69,58.42 53.98,58.42 48.26,52.7 45.72,52.7 43.81,54.61 29.21,54.61 | 29.21,54.61 V1.7 | X4.2 22.93,48.34 29.21,54.61 | C23.1 59.69,58.42 | C24.1 92.71,58.42
PP_N15V0_OPAMP
  Top 0.813: IC3.4 114.3,17.78 | 114.3,17.78 114.3,15.88 | 114.3,15.88 C3.1 116.2,12.06 137.79,12.06 C4.1 | IC1.4 20.32,17.78 | 20.32,17.78 C1.1 22.23,12.06 43.81,12.06 C2.1 | IC2.4 46.99,19.05 49.53,16.51 52.07,16.51 R10.1 60.33,19.05 | 71.12,35.56 61.59,35.56 60.33,34.29 60.33,19.05 | 114.3,15.88 85.72,15.88 84.45,14.61 84.45,3.17 83.19,1.91 67.94,1.91 66.67,3.17 66.67,17.14 64.77,19.05 60.33,19.05 | R12.1 146.69,17.14 143.51,17.14 141.6,19.05 IC4.4 | R3.1 20.32,17.78 | R6.1 114.3,17.78
  Top 1.422: IC5.OUT 71.12,35.56 71.12,39.37 | 71.12,39.37 C18.1 | C17.- 71.12,39.37
  Bottom 0.813: IC2.4 C2.1 | IC4.4 C4.1
PP_P15V0_OPAMP
  Top 0.813: IC1.7 15.24,27.94 C9.1 12.7,32.38 19.05,38.73 25.4,38.73 33.66,30.48 C11.1 39.37,30.48 | IC2.7 40.64,27.94 39.37,29.21 39.37,30.48 | IC4.7 134.62,27.94 C15.1 127.64,30.48 119.38,38.73 113.03,38.73 106.68,32.38 | IC3.7 109.22,27.94 C13.1 106.68,32.38 | C19.+ 78.74,46.99 64.14,46.99 59.05,41.91 48.26,41.91 39.37,33.02 39.37,30.48 | 106.68,32.38 103.5,35.56 86.36,35.56
  Top 1.422: IC6.3 86.36,35.56 86.36,39.37 | 86.36,39.37 C20.1 | C19.+ 86.36,39.37
PP_P450V_L_PLATE
  Top 1.422: R21.2 R22.2 59.37,95.25 | 59.37,95.25 C29.+ 59.37,105.48 J2.1 | 59.37,95.25 59.37,92.14 C25.1
PP_P450V_R_PLATE
  Top 1.422: R24.2 R23.2 93.03,95.25 | J2.3 93.03,105.48 C30.+ 93.03,95.25 | 93.03,95.25 93.03,92.14 C26.1
R_INPUT
  Top 0.813: X3.1 R1.2 109.86,8.89 140.97,8.89 142.24,10.16 142.24,14.61 140.97,15.88 137.79,15.88 137.16,16.51 IC4.3
R_STATOR_N
  Top 1.422: C28.2 132.72,112.14 | 132.72,112.14 132.46,112.14 R28.2 | J3.3 132.72,115.33 132.72,112.14
R_STATOR_P
  Top 1.422: R27.2 121.53,110.88 J3.1 118.61,121.03 C32.2

### Text on the board
tPlace: CV181-Z Diameter | CV181-Z Diameter | GND | SIG | VIN- | GND | VIN+ | GND | SIG | Simple Differential Electrostatic Rev. 1 | SPRING 2017 | kramnik@mit.edu